# Altium schematic sheet Board.SchDoc: CTL122: Board
size Letter; Engineer: Stephanos; DocumentNumber: 001; Revision: A1; SheetNumber: 1; SheetTotal: 1
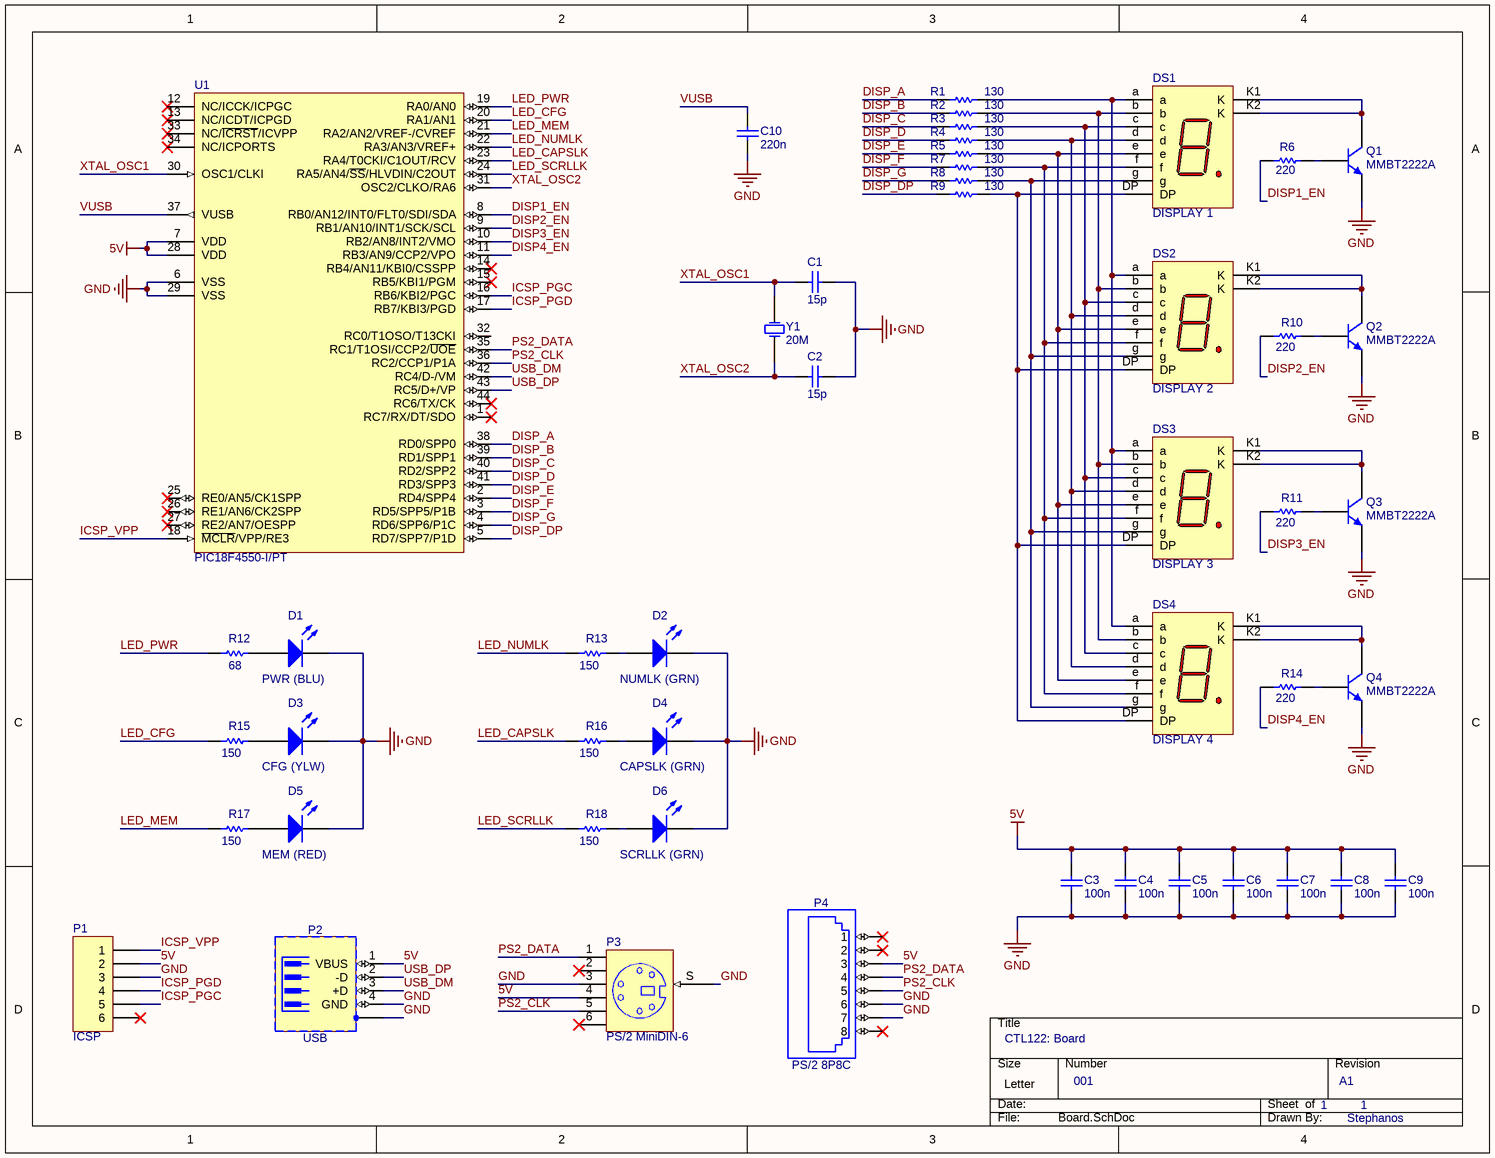
[diagram p0: Board.SchDoc]

## Parts
C1  value 15p  [0805]  (hidden comment: CAP)
C2  value 15p  [0805]  (hidden comment: CAP)
C3  value 100n  [0805]  (hidden comment: CAP)
C4  value 100n  [0805]  (hidden comment: CAP)
C5  value 100n  [0805]  (hidden comment: CAP)
C6  value 100n  [0805]  (hidden comment: CAP)
C7  value 100n  [0805]  (hidden comment: CAP)
C8  value 100n  [0805]  (hidden comment: CAP)
C9  value 100n  [0805]  (hidden comment: CAP)
C10  value 220n  [0805]  (hidden comment: CAP)
D1  PWR (BLU)  [1206P]
D2  NUMLK (GRN)  [1206P]
D3  CFG (YLW)  [1206P]
D4  CAPSLK (GRN)  [1206P]
D5  MEM (RED)  [1206P]
D6  SCRLLK (GRN)  [1206P]
DS1  DISPLAY 1  [7SEG]
DS2  DISPLAY 2  [7SEG]
DS3  DISPLAY 3  [7SEG]
DS4  DISPLAY 4  [7SEG]
P1  ICSP  [HDR1X6]
P2  USB  [TYCO_292304-1]
P3  PS/2 MiniDIN-6  [PS2-6PIN]
P4  PS/2 8P8C  [FCI_54602-908LF]
Q1  MMBT2222A  [SOT-23]
Q2  MMBT2222A  [SOT-23]
Q3  MMBT2222A  [SOT-23]
Q4  MMBT2222A  [SOT-23]
R1  value 130  [0805]  (hidden comment: RES)
R2  value 130  [0805]  (hidden comment: RES)
R3  value 130  [0805]  (hidden comment: RES)
R4  value 130  [0805]  (hidden comment: RES)
R5  value 130  [0805]  (hidden comment: RES)
R6  value 220  [0805]  (hidden comment: RES)
R7  value 130  [0805]  (hidden comment: RES)
R8  value 130  [0805]  (hidden comment: RES)
R9  value 130  [0805]  (hidden comment: RES)
R10  value 220  [0805]  (hidden comment: RES)
R11  value 220  [0805]  (hidden comment: RES)
R12  value 68  [0805]  (hidden comment: RES)
R13  value 150  [0805]  (hidden comment: RES)
R14  value 220  [0805]  (hidden comment: RES)
R15  value 150  [0805]  (hidden comment: RES)
R16  value 150  [0805]  (hidden comment: RES)
R17  value 150  [0805]  (hidden comment: RES)
R18  value 150  [0805]  (hidden comment: RES)
U1  PIC18F4550-I/PT  [TQFP-PT44_N]
Y1  value 20M  [HC49]  (hidden comment: XTAL)

## Nets
5V: C3.2 C4.2 C5.2 C6.2 C7.2 C8.2 C9.2 P1.2 P2.1(VBUS) P3.4 P4.3 U1.7(VDD) U1.28(VDD)
GND: C1.2 C2.2 C3.1 C4.1 C5.1 C6.1 C7.1 C8.1 C9.1 C10.1 D1.K D2.K D3.K D4.K D5.K D6.K P1.3 P2.4(GND) P2.5(SH) P3.3 P3.S P4.6 P4.7 Q1.E Q2.E Q3.E Q4.E U1.6(VSS) U1.29(VSS)
DISP1_EN: R6.1 U1.8(RB0/AN12/INT0/FLT0/SDI/SDA)
DISP2_EN: R10.1 U1.9(RB1/AN10/INT1/SCK/SCL)
DISP3_EN: R11.1 U1.10(RB2/AN8/INT2/VMO)
DISP4_EN: R14.1 U1.11(RB3/AN9/CCP2/VPO)
DISP_A: R1.1 U1.38(RD0/SPP0)
DISP_B: R2.1 U1.39(RD1/SPP1)
DISP_C: R3.1 U1.40(RD2/SPP2)
DISP_D: R4.1 U1.41(RD3/SPP3)
DISP_DP: R9.1 U1.5(RD7/SPP7/P1D)
DISP_E: R5.1 U1.2(RD4/SPP4)
DISP_F: R7.1 U1.3(RD5/SPP5/P1B)
DISP_G: R8.1 U1.4(RD6/SPP6/P1C)
ICSP_PGC: P1.5 U1.16(RB6/KBI2/PGC)
ICSP_PGD: P1.4 U1.17(RB7/KBI3/PGD)
ICSP_VPP: P1.1 U1.18(~{MCLR}/VPP/RE3)
LED_CAPSLK: R16.1 U1.23(RA4/T0CKI/C1OUT/RCV)
LED_CFG: R15.1 U1.20(RA1/AN1)
LED_MEM: R17.1 U1.21(RA2/AN2/VREF-/CVREF)
LED_NUMLK: R13.1 U1.22(RA3/AN3/VREF+)
LED_PWR: R12.1 U1.19(RA0/AN0)
LED_SCRLLK: R18.1 U1.24(RA5/AN4/~{SS}/HLVDIN/C2OUT)
PS2_CLK: P3.5 P4.5 U1.36(RC2/CCP1/P1A)
PS2_DATA: P3.1 P4.4 U1.35(RC1/T1OSI/CCP2/~{UOE})
USB_DM: P2.3(+D) U1.42(RC4/D-/VM)
USB_DP: P2.2(-D) U1.43(RC5/D+/VP)
VUSB: C10.2 U1.37(VUSB)
XTAL_OSC1: C1.1 U1.30(OSC1/CLKI) Y1.2
XTAL_OSC2: C2.1 U1.31(OSC2/CLKO/RA6) Y1.1
NetD1_A: D1.A R12.2
NetD2_A: D2.A R13.2
NetD3_A: D3.A R15.2
NetD4_A: D4.A R16.2
NetD5_A: D5.A R17.2
NetD6_A: D6.A R18.2
NetDS1_a: DS1.a DS2.a DS3.a DS4.a R1.2
NetDS1_b: DS1.b DS2.b DS3.b DS4.b R2.2
NetDS1_c: DS1.c DS2.c DS3.c DS4.c R3.2
NetDS1_d: DS1.d DS2.d DS3.d DS4.d R4.2
NetDS1_DP: DS1.DP DS2.DP DS3.DP DS4.DP R9.2
NetDS1_e: DS1.e DS2.e DS3.e DS4.e R5.2
NetDS1_f: DS1.f DS2.f DS3.f DS4.f R7.2
NetDS1_g: DS1.g DS2.g DS3.g DS4.g R8.2
NetDS1_K1: DS1.K1(K) DS1.K2(K) Q1.C
NetDS2_K1: DS2.K1(K) DS2.K2(K) Q2.C
NetDS3_K1: DS3.K1(K) DS3.K2(K) Q3.C
NetDS4_K1: DS4.K1(K) DS4.K2(K) Q4.C
NetQ1_B: Q1.B R6.2
NetQ2_B: Q2.B R10.2
NetQ3_B: Q3.B R11.2
NetQ4_B: Q4.B R14.2

Not connected (* = marked no-connect by the designer): P1 6*; P3 2* 6*; P4 1* 2* 8*; U1 1(RC7/RX/DT/SDO)* 12(NC/ICCK/ICPGC)* 13(NC/ICDT/ICPGD)* 14(RB4/AN11/KBI0/CSSPP)* 15(RB5/KBI1/PGM)* 25(RE0/AN5/CK1SPP)* 26(RE1/AN6/CK2SPP)* 27(RE2/AN7/OESPP)* 32(RC0/T1OSO/T13CKI) 33(NC/~{ICRST}/ICVPP)* 34(NC/ICPORTS)* 44(RC6/TX/CK)*

## Library data of the parts
C1-C10 = CAP: Capacitor
D1-D6 = LED: Light Emitting Diode; pin to pad: A>2 K>1; Supplier 1: Digi-Key
  D1: Supplier Part Number 1: 516-1446-6-ND
  D2 D4 D6: Supplier Part Number 1: 516-1443-1-ND
  D3: Supplier Part Number 1: 516-1442-1-ND
  D5: Supplier Part Number 1: 516-1439-6-ND
DS1-DS4 = 7SEG-CC: 7-segment Display Common Cathode; pin to pad: a>1 b>10 c>8 d>5 DP>7 e>4 f>2 g>3 K1>6 K2>9
P1 = Header 6: Header, 6-Pin; LatestRevisionDate: 17-Jul-2002; LatestRevisionNote: Re-released for DXP Platform.; Publisher: Altium Limited
P2 = TYCO_292304-1: 4 Pin + 1 Shield USB Receptacle; Part Description: Thru Hole, Right Angle, 4 Position, Type B, USB Receptacle; Manufacturer: TYCO ELECTRONICS; Table: TYCO; Part Number: TYCO_292304-1; Component Kind: Standard; Component Type: Standard; Pin Count: 5; Family: USB; Mounted: Yes; Socket: No; SMD: No; Status: None; Manufacturer Part Number: 292304-1; ComponentHeight: 11.5mm; HelpURL: \\cern.ch\dfs\Applications\Altium\Datasheets\TYCO_292304-1.pdf; Author: CERN DEM JLC; CreateDate: 2010-07-16; LatestRevisionDate: 2010-07-16
P3 = PS2-6PIN: 6 Pin Through Hole PS2 Socket (Kycon P/N); Published: 17-Dec-2003; Publisher: Altium Limited; ComponentLink1Description: Manufacturer Link; ComponentLink1URL: http://www.oupiin.com/prodindx.html#Headers
P4 = FCI_54602-908LF: 1 Port, 8 Positions, CAT3 RJ45 Horizontal Modular Jack; Manufacturer: FCI; Part Number: FCI_54602-908LF; Component Kind: Standard; Component Type: Standard; Pin Count: 8; Family: RJ45; Mounted: Yes; Socket: No; SMD: No; Status: None; Part Description: 1 Port, 8 Positions, CAT3 RJ45 Horizontal Modular Jack; Manufacturer Part Number: 54602-908LF; ComponentHeight: 10.43mm; HelpURL: \\cern.ch\dfs\Applications\Altium\Datasheets\FCI_54602-908LF.pdf; Author: CERN DEM JLC; CreateDate: 2013-01-28; LatestRevisionDate: 2013-01-28; Table: FCI
Q1-Q4 = NPN: Bipolar NPN Transistor; pin to pad: B>1 C>2 E>3
R1-R18 = RES: Resistor
U1 = PIC18F4550-I/PT: High Performance, Enhanced Flash, USB Microcontroller with nanoWatt Technology, 32K Flash, 44-Pin TQFP, Industrial Temperature Range; Published: 29-Jan-2009; LatestRevisionDate: 02-Dec-2009; LatestRevisionNote: Updated to datasheet revision E, Aug-2008; DatasheetVersion: revE, Aug-2008; PackageVersion: revBB, Aug-2009; PackageReference: TQFP-PT44; Publisher: Altium Limited; PackageDescription: 44-Lead Plastic Thin Quad Flatpack (PT) - 10x10x1mm Body, 2.00mm [TQFP]; Supplier 1: Digi-Key; Supplier Part Number 1: PIC18F4550-I/PT-ND; Supplier 2: Farnell; Supplier Part Number 2: 9321365; Supplier 3: Farnell; Supplier Part Number 3: 1528447; Code_JEDEC: MS-026; ComponentLink1Description: Datasheet; ComponentLink1URL: http://ww1.microchip.com/downloads/en/DeviceDoc/39632e.pdf; ComponentLink2Description: Packaging Specification; ComponentLink2URL: http://www.microchip.com/stellent/groups/techpub_sg/documents/packagingspec/en012702.pdf; ComponentLink3Description: Microchip.com Home; ComponentLink3URL: http://www.microchip.com/
Y1 = XTAL: Crystal Oscillator